# EAGLE schematic bc-module-relay (EAGLE 7.7.0)
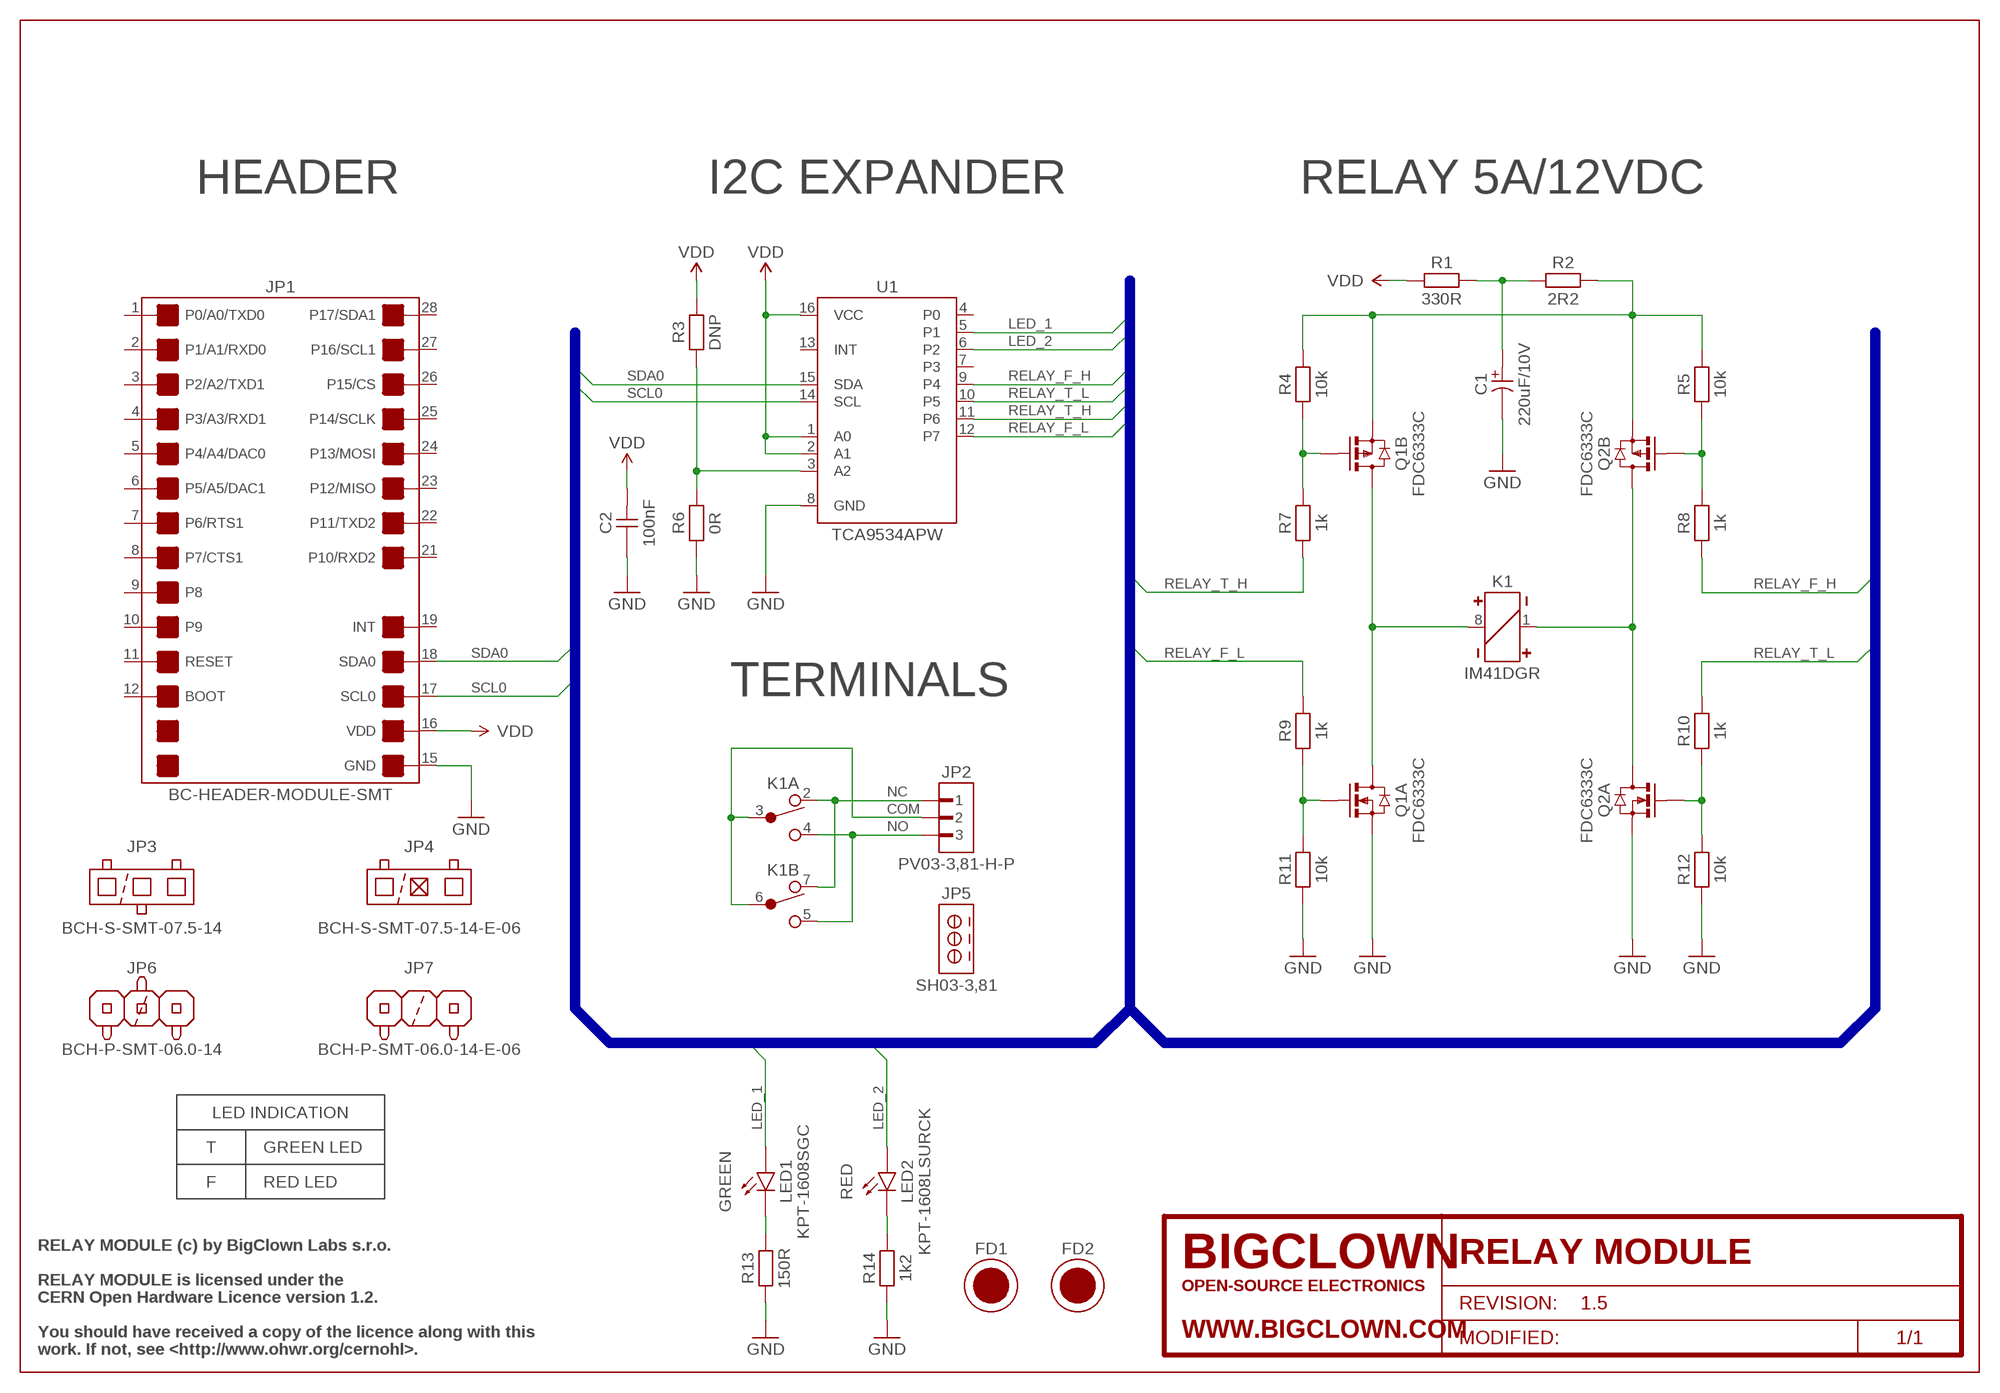
[diagram p0: schematic, sheet 1]
JP5 (JP-SH03-3,81): BCPN: BC-JP-SH03-3,81; VALUE: SH03-3,81

## Parts
C1  220uF/10V  C-7343-D-220UF-10V  [CAPACITOR-7343-D_R]
C2  100nF  C-0603-100NF  [CAPACITOR-0603_R]
FD1  FIDUCIAL  [FIDUCIAL-1MM]
FD2  FIDUCIAL  [FIDUCIAL-1MM]
FRAME1  FRAME-SCH/A4L-BRD/A4L  [FRAME-A4L]
JP1  BC-HEADER-MODULE-SMT  [BC-HEADER-MODULE-SMT]
JP2  PV03-3,81-H-P  JP-PV03-3,81-H-P  [PV03-3,81-H-P_R]
JP3  BCH-S-SMT-07.5-14  JP-BCH-S-SMT-07.5-14  [BCH-S-SMT-14]
JP4  BCH-S-SMT-07.5-14-E-06  JP-BCH-S-SMT-07.5-14-E-06  [BCH-S-SMT-14-E-06]
JP6  BCH-P-SMT-06.0-14  JP-BCH-P-SMT-06.0-14  [BCH-P-SMT-14]
JP7  BCH-P-SMT-06.0-14-E-06  JP-BCH-P-SMT-06.0-14-E-06  [BCH-P-SMT-14-E-06]
K1  IM41DGR  K-IM41DGR  [IM41DGR_R]
LED1  KPT-1608SGC  LED-KPT-1608SGC  [KPT-1608SGC_R]
LED2  KPT-1608LSURCK  LED-KPT-1608LSURCK  [KPT-1608LSURCK_R]
Q1  FDC6333C  Q-FDC6333C  [SSOT-6L_R]
Q2  FDC6333C  Q-FDC6333C  [SSOT-6L_R]
R1  330R  R-1206-330R  [RESISTOR-1206_R]
R2  2R2  R-1206-2R2  [RESISTOR-1206_R]
R3  DNP  R-0805-DNP  [RESISTOR-0805_R]
R4  10k  R-0603-10K  [RESISTOR-0603_R]
R5  10k  R-0603-10K  [RESISTOR-0603_R]
R6  0R  R-0805-0R  [RESISTOR-0805_R]
R7  1k  R-0603-1K  [RESISTOR-0603_R]
R8  1k  R-0603-1K  [RESISTOR-0603_R]
R9  1k  R-0603-1K  [RESISTOR-0603_R]
R10  1k  R-0603-1K  [RESISTOR-0603_R]
R11  10k  R-0603-10K  [RESISTOR-0603_R]
R12  10k  R-0603-10K  [RESISTOR-0603_R]
R13  150R  R-0603-150R  [RESISTOR-0603_R]
R14  1k2  R-0603-1K2  [RESISTOR-0603_R]
U1  TCA9534APW  U-TCA9534APW  [TCA9534APW_R]

## Nets
A2: R3.1 R6.2 U1.3(A2)
COIL_1: K1.1(C:M) Q2.4(B:D) Q2.6(A:D)
COIL_2: K1.8(C:P) Q1.4(B:D) Q1.6(A:D)
COM: JP2.2 K1.3(A:C) K1.6(B:C)
GND: C1.C C2.2 JP1.15(GND) Q1.5(A:S) Q2.5(A:S) R6.1 R11.1 R12.1 R13.1 R14.1 U1.8(GND)
LED_1: LED1.A U1.5(P1)
LED_1_C: LED1.C R13.2
LED_2: LED2.A U1.6(P2)
LED_2_C: LED2.C R14.2
NC: JP2.1 K1.2(A:NC) K1.7(B:NC)
NC_H_G: Q1.3(B:G) R4.1 R7.2
NC_L_G: Q2.1(A:G) R10.1 R12.2
NO: JP2.3 K1.4(A:NO) K1.5(B:NO)
NO_H_G: Q2.3(B:G) R5.1 R8.2
NO_L_G: Q1.1(A:G) R9.2 R11.2
RELAY_F_H: R8.1 U1.9(P4)
RELAY_F_L: R9.1 U1.12(P7)
RELAY_T_H: R7.1 U1.11(P6)
RELAY_T_L: R10.2 U1.10(P5)
SCL0: JP1.17(SCL0) U1.14(SCL)
SDA0: JP1.18(SDA0) U1.15(SDA)
VDD: C2.1 JP1.16(VDD) R1.2 R3.2 U1.1(A0) U1.2(A1) U1.16(VCC)
VDD_CAP: C1.A R1.1 R2.2
VDD_PMOS: Q1.2(B:S) Q2.2(B:S) R2.1 R4.2 R5.2
Unconnected: JP1.1(P0/A0/TXD0) JP1.2(P1/A1/RXD0) JP1.3(P2/A2/TXD1) JP1.4(P3/A3/RXD1) JP1.5(P4/A4/DAC0) JP1.6(P5/A5/DAC1) JP1.7(P6/RTS1) JP1.8(P7/CTS1) JP1.9(P8) JP1.10(P9) JP1.11(RESET) JP1.12(BOOT) JP1.19(INT) JP1.21(P10/RXD2) JP1.22(P11/TXD2) JP1.23(P12/MISO) JP1.24(P13/MOSI) JP1.25(P14/SCLK) JP1.26(P15/CS) JP1.27(P16/SCL1) JP1.28(P17/SDA1) U1.4(P0) U1.7(P3) U1.13(INT)

## Buses
SDA0,SCL0,RELAY_T_L,RELAY_T_H,RELAY_F_L,RELAY_F_H,LED_1,LED_2

## Notes on the sheet
- HEADER | I2C EXPANDER | RELAY 5A/12VDC
- TERMINALS
- LED INDICATION
- T | GREEN LED
- F | RED LED | GREEN | RED
- RELAY MODULE (c) by BigClown Labs s.r.o.
- RELAY MODULE is licensed under the
- CERN Open Hardware Licence version 1.2.
- You should have received a copy of the licence along with this
- work. If not, see <http://www.ohwr.org/cernohl>.

## Library data of the parts
C1 = bc-capacitor:C-7343-D-220UF-10V; BCPN: BC-C-7343-D-220UF-10V
C2 = bc-capacitor:C-0603-100NF; BCPN: BC-C-0603-100NF
FD1 FD2 = bc-fiducial:FIDUCIAL; BCPN: -
FRAME1 = bc-frame:FRAME-SCH/A4L-BRD/A4L; BCPN: -; PROJECT_NAME: RELAY MODULE; PROJECT_REVISION: 1.5
JP1 = bc-header:BC-HEADER-MODULE-SMT; BCPN: -
JP2 = bc-connector:JP-PV03-3,81-H-P; BCPN: BC-JP-PV03-3,81-H-P
JP3 = bc-header:JP-BCH-S-SMT-07.5-14; BCPN: BC-JP-BCH-S-SMT-07.5-14
JP4 = bc-header:JP-BCH-S-SMT-07.5-14-E-06; BCPN: BC-JP-BCH-S-SMT-07.5-14-E-06
JP6 = bc-header:JP-BCH-P-SMT-06.0-14; BCPN: BC-JP-BCH-P-SMT-06.0-14
JP7 = bc-header:JP-BCH-P-SMT-06.0-14-E-06; BCPN: BC-JP-BCH-P-SMT-06.0-14-E-06
K1 = bc-relay:K-IM41DGR; BCPN: BC-K-IM41DGR
LED1 = bc-led:LED-KPT-1608SGC; BCPN: BC-LED-KPT-1608SGC
LED2 = bc-led:LED-KPT-1608LSURCK; BCPN: BC-LED-KPT-1608LSURCK
Q1 Q2 = bc-discrete:Q-FDC6333C; BCPN: BC-Q-FDC6333C
R1 = bc-resistor:R-1206-330R; BCPN: BC-R-1206-330R
R2 = bc-resistor:R-1206-2R2; BCPN: BC-R-1206-2R2
R3 = bc-resistor:R-0805-DNP; BCPN: -
R4 R5 R11 R12 = bc-resistor:R-0603-10K; BCPN: BC-R-0603-10k
R6 = bc-resistor:R-0805-0R; BCPN: BC-R-0805-0R
R7-R10 = bc-resistor:R-0603-1K; BCPN: BC-R-0603-1k
R13 = bc-resistor:R-0603-150R; BCPN: BC-R-0603-150R
R14 = bc-resistor:R-0603-1K2; BCPN: BC-R-0603-1k2
U1 = bc-interface:U-TCA9534APW; BCPN: BC-U-TCA9534APW